# Altium schematic sheet Front_panel_FFC.SchDoc: Front panel FFC connector
size A4; EDA_Number: ARTIQ; Projet: Fastino; CheckedBy: Maciej Przybysz; Author: Michał Piętka; Organization: Technosystem; Address1: Słoneczna 125, 05-506 Kolonia Lesznowola; Address2: https://technosystem.pl/; Address4: (NOT USED); DocumentNumber: 1; Revision: 0; SheetNumber: 1; SheetTotal: 1
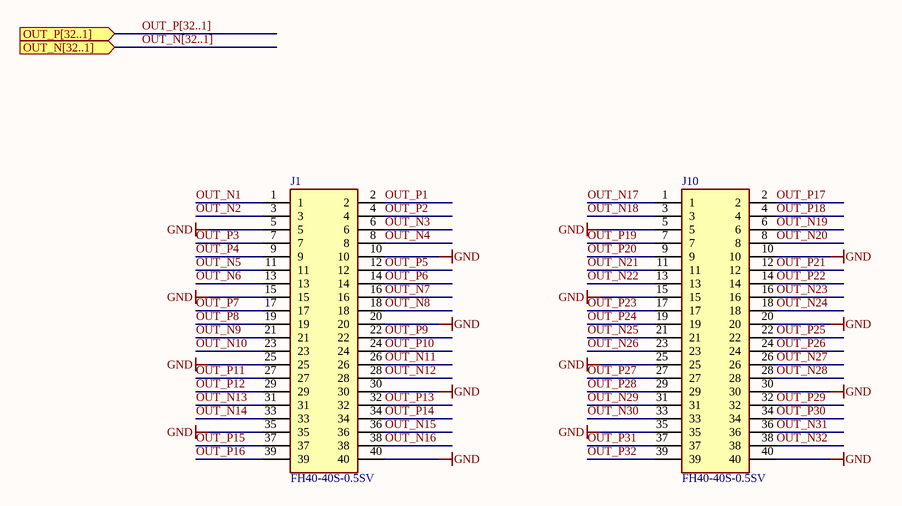
[diagram p0: Front_panel_FFC.SchDoc]

## Parts
J1  FH40-40S-0.5SV  [FH4040S05SV]
J10  FH40-40S-0.5SV  [FH4040S05SV]

## Ports
OUT_N[32..1] (in), OUT_P[32..1] (in)

## Nets
GND: J1.5 J1.10 J1.15 J1.20 J1.25 J1.30 J1.35 J1.40 J10.5 J10.10 J10.15 J10.20 J10.25 J10.30 J10.35 J10.40
OUT_N1: J1.1
OUT_N2: J1.3
OUT_N3: J1.6
OUT_N4: J1.8
OUT_N5: J1.11
OUT_N6: J1.13
OUT_N7: J1.16
OUT_N8: J1.18
OUT_N9: J1.21
OUT_N10: J1.23
OUT_N11: J1.26
OUT_N12: J1.28
OUT_N13: J1.31
OUT_N14: J1.33
OUT_N15: J1.36
OUT_N16: J1.38
OUT_N17: J10.1
OUT_N18: J10.3
OUT_N19: J10.6
OUT_N20: J10.8
OUT_N21: J10.11
OUT_N22: J10.13
OUT_N23: J10.16
OUT_N24: J10.18
OUT_N25: J10.21
OUT_N26: J10.23
OUT_N27: J10.26
OUT_N28: J10.28
OUT_N29: J10.31
OUT_N30: J10.33
OUT_N31: J10.36
OUT_N32: J10.38
OUT_P1: J1.2
OUT_P2: J1.4
OUT_P3: J1.7
OUT_P4: J1.9
OUT_P5: J1.12
OUT_P6: J1.14
OUT_P7: J1.17
OUT_P8: J1.19
OUT_P9: J1.22
OUT_P10: J1.24
OUT_P11: J1.27
OUT_P12: J1.29
OUT_P13: J1.32
OUT_P14: J1.34
OUT_P15: J1.37
OUT_P16: J1.39
OUT_P17: J10.2
OUT_P18: J10.4
OUT_P19: J10.7
OUT_P20: J10.9
OUT_P21: J10.12
OUT_P22: J10.14
OUT_P23: J10.17
OUT_P24: J10.19
OUT_P25: J10.22
OUT_P26: J10.24
OUT_P27: J10.27
OUT_P28: J10.29
OUT_P29: J10.32
OUT_P30: J10.34
OUT_P31: J10.37
OUT_P32: J10.39

## Buses and harness runs
bus OUT_N[32..1] = port OUT_N[32..1]
bus OUT_P[32..1] = port OUT_P[32..1]

## Notes on the sheet
- Project:
- Version:
- Designed by:
- Checked by:
- Filename:
- Size:
- Date:
- Sheet:
- A4

## Library data of the parts
J1 J10 = FH40-40S-0.5SV: Connector; Manufacturer_Name: Hirose; Part Number: 798-FH40-40S-0.5SV; Datasheet Link: https://datasheet.datasheetarchive.com/originals/distributors/Datasheets-DGA16/847294.pdf; Height: 6mm; Mouser Part Number: 798-FH40-40S-0.5SV; Mouser Price/Stock: https://www.mouser.co.uk/ProductDetail/Hirose-Connector/FH40-40S-05SV/?qs=Y%252Ba6yYk543mLwEJVPI7oow%3D%3D; Manufacturer Part Number: FH40-40S-0.5SV